# EAGLE design BackscatterPlantSensor_v5 (EAGLE 6.4)
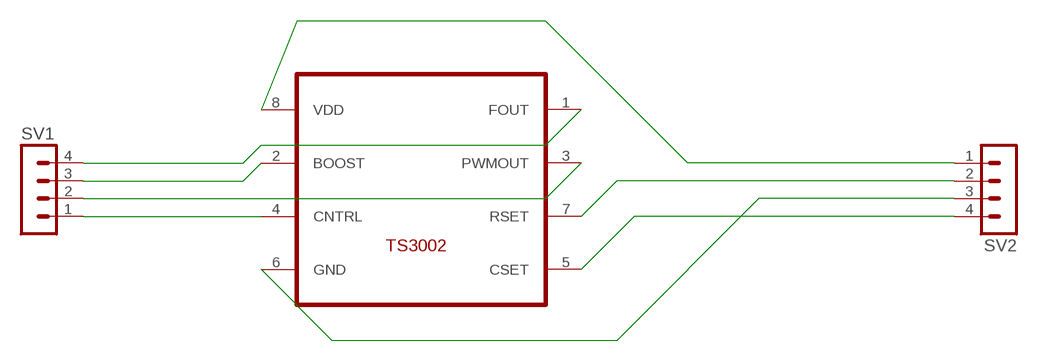
[diagram p0: schematic, sheet 1]

## Parts
SV1  MA04-1  [MA04-1]
SV2  MA04-1  [MA04-1]
U$1  TS3002  [TDFN22-8]

## Nets
N$1: SV1.1 U$1.4(CNTRL)
N$2: SV1.2 U$1.3(PWMOUT)
N$3: SV1.3 U$1.2(BOOST)
N$4: SV1.4 U$1.1(FOUT)
N$5: SV2.1 U$1.8(VDD)
N$6: SV2.2 U$1.7(RSET)
N$7: SV2.3 U$1.6(GND)
N$8: SV2.4 U$1.5(CSET)

## Library data of the parts
SV1 SV2 = con-lstb:MA04-1: PIN HEADER; OC_FARNELL: unknown; OC_NEWARK: unknown
U$1 = ts3002TDFN22_8pin:TS3002

## Board
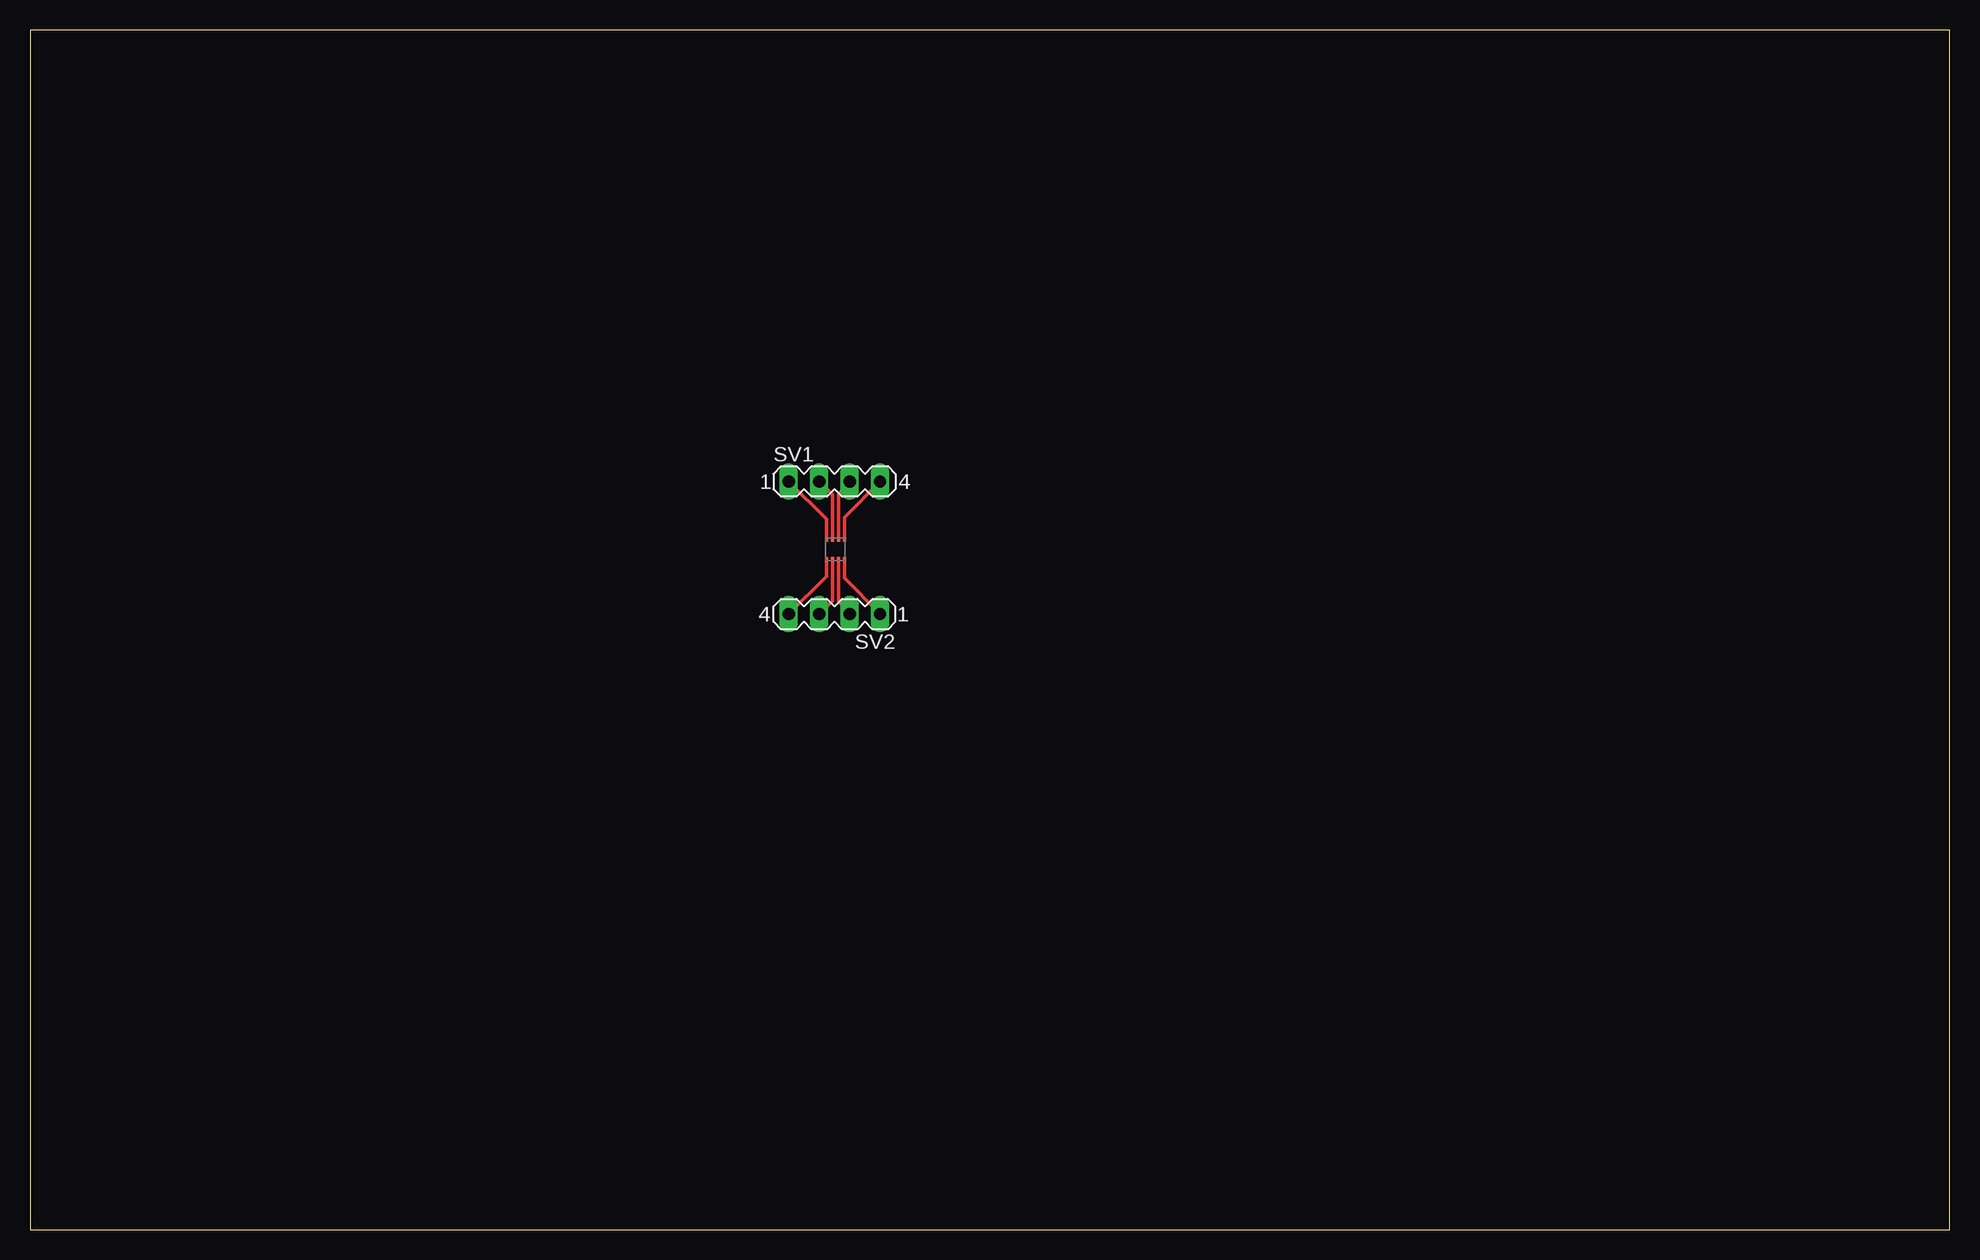
[diagram p1: board, top side]

Size 160 x 100 mm. Coordinates in mm from the lower left corner, seen from the top.
Outline: 0,0 160,0 160,100 0,100 0,0
Copper layers (1*16): Top 0.035mm / dielectric 1.5mm / Bottom 0.035mm
Design rules "default": minimum track width 10mil, minimum drill 24mil, track to track 8mil, track to pad 8mil, pad to pad 8mil, via to via 8mil, smd to smd 8mil, copper to edge 40mil, drill to drill 8mil, minimum pad ring 10mil, minimum via ring 8mil, stop-mask expansion 4mil, vias tented up to drill 0mil, thermal gap 10mil

### Footprints (pad centres in the part's own frame; a part is rotated, then mirrored left to right if it is on the bottom)
MA04-1 = drill 1.016 long: 1 -3.81,0; 2 -1.27,0; 3 1.27,0; 4 3.81,0
TDFN22-8 = smd 0.35 x 0.25: 1 -1.78,-0.7; 2 -1.78,-1.2; 3 -1.78,-1.7; 4 -1.78,-2.2; 5 -0.13,-2.2; 6 -0.13,-1.7; 7 -0.13,-1.2; 8 -0.13,-0.7

### Placement (x,y rotation side)
SV1  67.06,62.36 0 top
SV2  67.06,51.31 180 top
U$1  68.58,55.75 270 top

### Tracks (layer width: path | path; a pad name or v marks a point on that pad's centre or on a via)
N$1
  Top 0.305: SV1.1 66.38,59.22 U$1.4
N$2
  Top 0.305: SV1.2 66.88,61.26 U$1.3
N$3
  Top 0.305: SV1.3 67.38,61.28 U$1.2
N$4
  Top 0.305: SV1.4 67.88,59.37 U$1.1
N$5
  Top 0.305: SV2.1 67.88,54.29 U$1.8
N$6
  Top 0.305: SV2.2 67.38,52.38 U$1.7
N$7
  Top 0.305: SV2.3 66.88,52.4 U$1.6
N$8
  Top 0.305: SV2.4 66.38,54.44 U$1.5